# Altium project RoboFly.PrjPCB
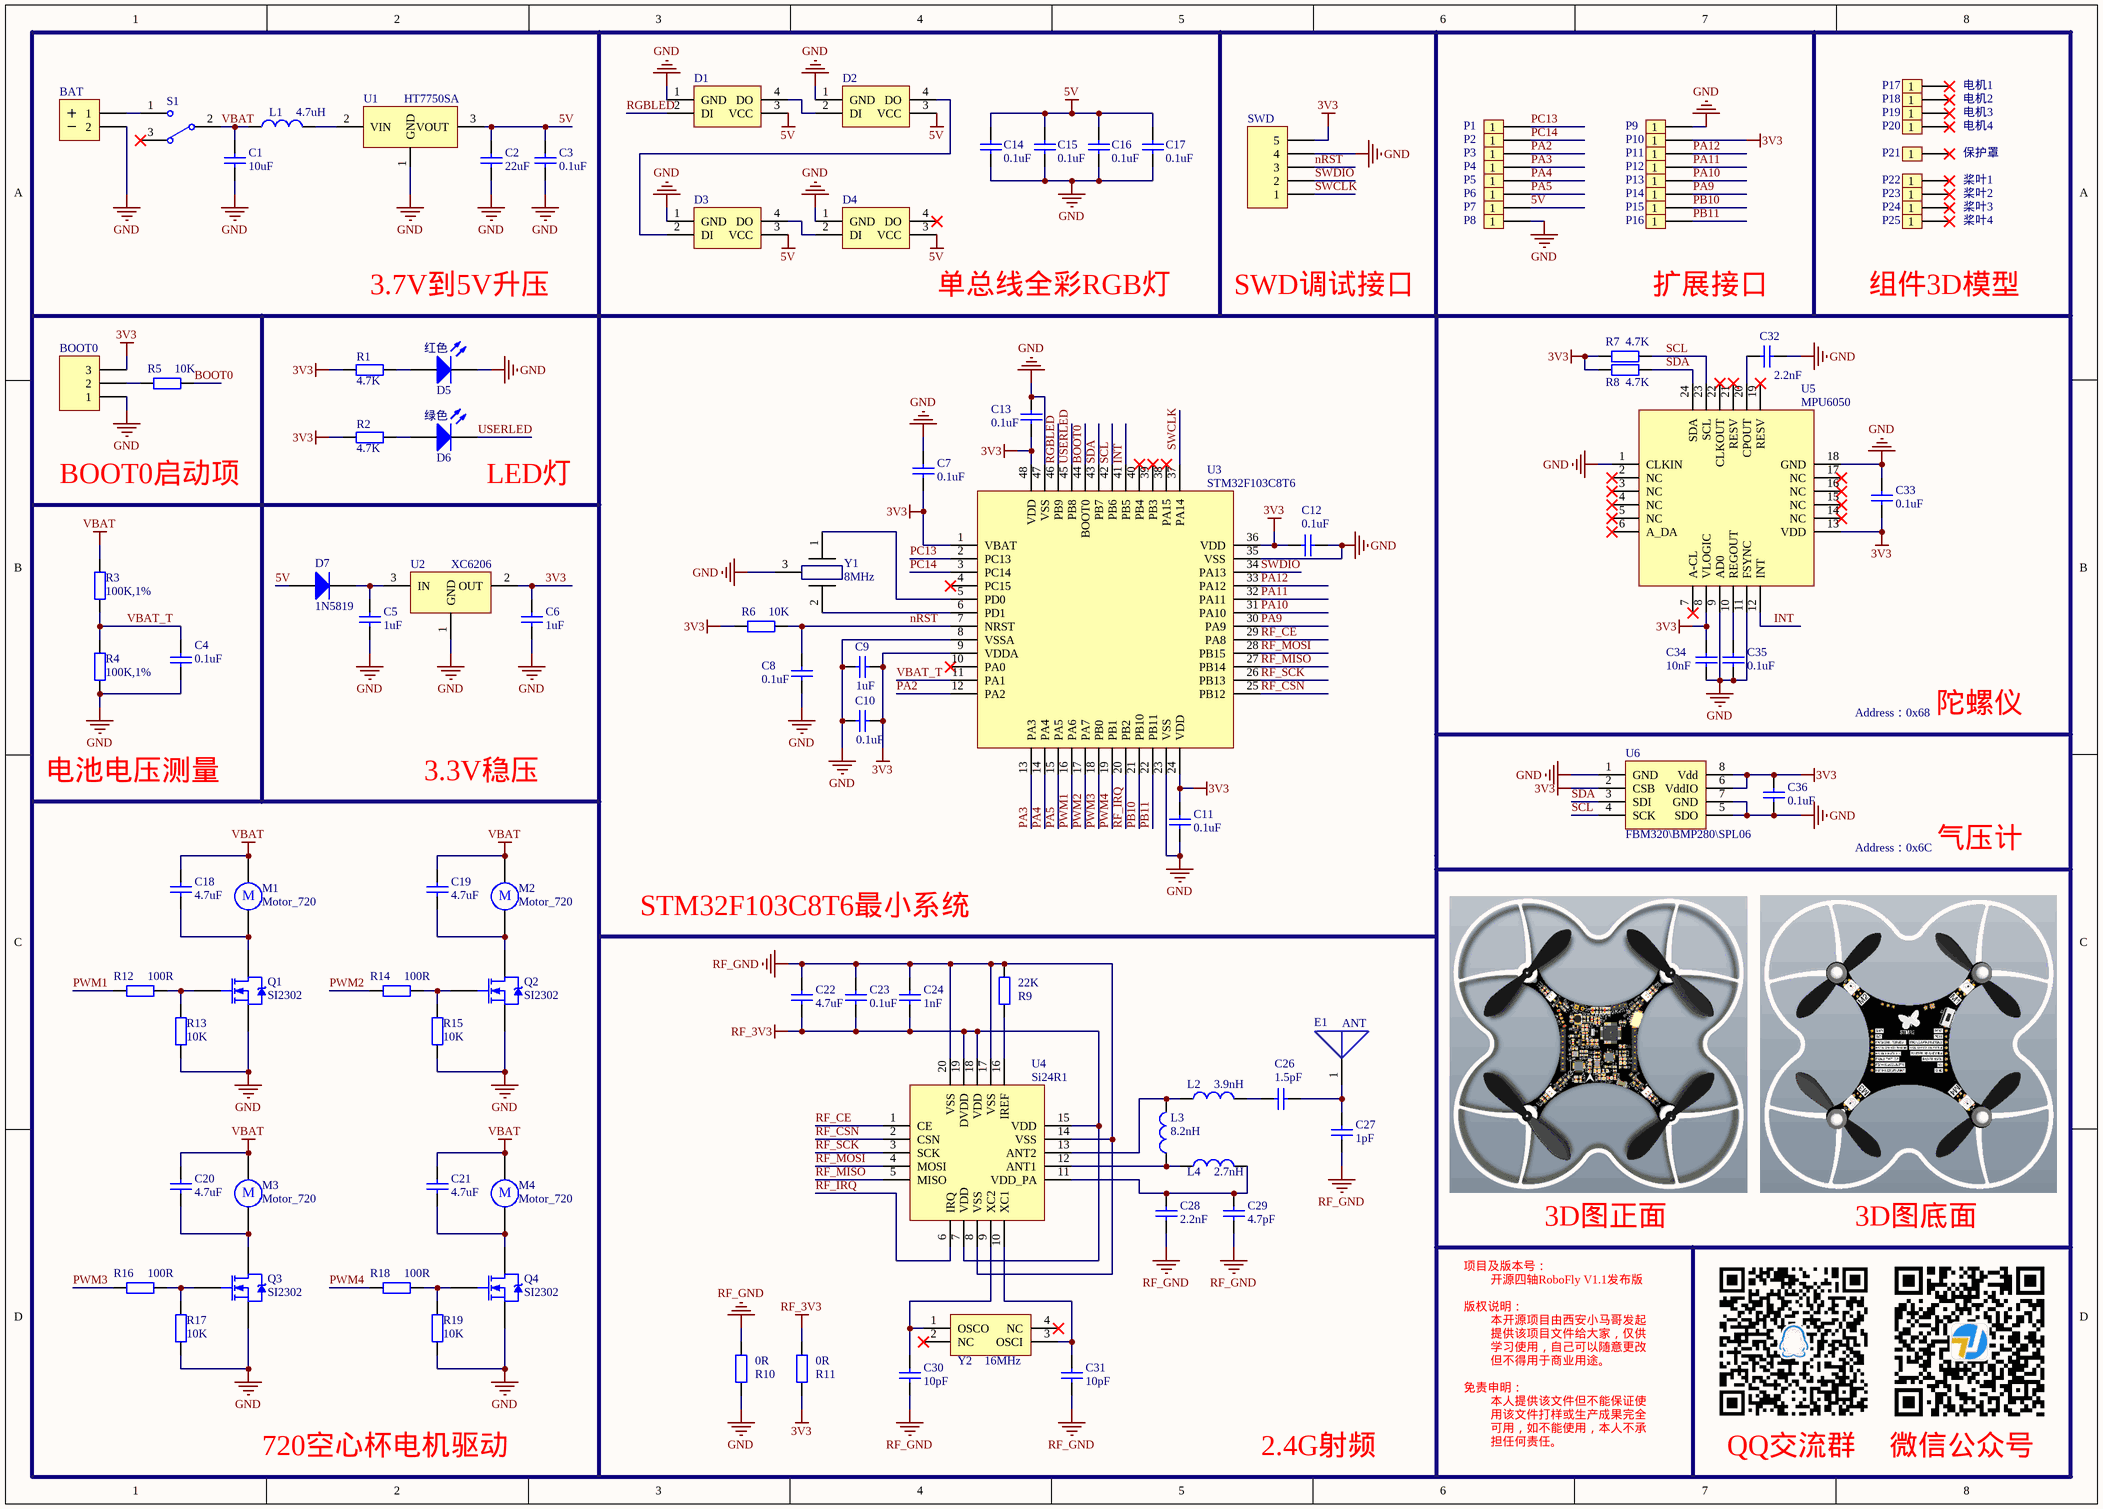
[diagram p0: RoboFly.SchDoc]
1 sheet, 111 parts. Net scope: global (net labels, ports and power ports of the same name join across sheets).
Board files: RoboFly.PcbDoc, STM32LOGO.PcbDoc

## Sheet RoboFly.SchDoc
size A3

### Parts
BAT  BAT  [BAT]  (value not drawn)
BOOT0  BOOT  [HEADER1X3]  (value not drawn)
C1  value 10uF  [C_0603]  (hidden comment: C_0603)
C2  value 22uF  [C_0603]  (hidden comment: C_0603)
C3  value 0.1uF  [C_0603]  (hidden comment: C_0603)
C4  value 0.1uF  [C_0603]  (hidden comment: C_0603)
C5  value 1uF  [C_0603]  (hidden comment: C_0603)
C6  value 1uF  [C_0603]  (hidden comment: C_0603)
C7  value 0.1uF  [C_0603]  (hidden comment: C_0603)
C8  value 0.1uF  [C_0603]  (hidden comment: C_0603)
C9  value 1uF  [C_0603]  (hidden comment: C_0603)
C10  value 0.1uF  [C_0603]  (hidden comment: C_0603)
C11  value 0.1uF  [C_0603]  (hidden comment: C_0603)
C12  value 0.1uF  [C_0603]  (hidden comment: C_0603)
C13  value 0.1uF  [C_0603]  (hidden comment: C_0603)
C14  value 0.1uF  [C_0603]  (hidden comment: C_0603)
C15  value 0.1uF  [C_0603]  (hidden comment: C_0603)
C16  value 0.1uF  [C_0603]  (hidden comment: C_0603)
C17  value 0.1uF  [C_0603]  (hidden comment: C_0603)
C18  value 4.7uF  [C_0603]  (hidden comment: C_0603)
C19  value 4.7uF  [C_0603]  (hidden comment: C_0603)
C20  value 4.7uF  [C_0603]  (hidden comment: C_0603)
C21  value 4.7uF  [C_0603]  (hidden comment: C_0603)
C22  value 4.7uF  [C_0603]  (hidden comment: C_0603)
C23  value 0.1uF  [C_0603]  (hidden comment: C_0603)
C24  value 1nF  [C_0603]  (hidden comment: C_0603)
C26  value 1.5pF  [C_0603]  (hidden comment: C_0603)
C27  value 1pF  [C_0603]  (hidden comment: C_0603)
C28  value 2.2nF  [C_0603]  (hidden comment: C_0603)
C29  value 4.7pF  [C_0603]  (hidden comment: C_0603)
C30  value 10pF  [C_0603]  (hidden comment: C_0603)
C31  value 10pF  [C_0603]  (hidden comment: C_0603)
C32  value 2.2nF  [C_0603]  (hidden comment: C_0603)
C33  value 0.1uF  [C_0603]  (hidden comment: C_0603)
C34  value 10nF  [C_0603]  (hidden comment: C_0603)
C35  value 0.1uF  [C_0603]  (hidden comment: C_0603)
C36  value 0.1uF  [C_0603]  (hidden comment: C_0603)
D1  P923D  [RGB_LED_5050]  (value not drawn)
D2  P923D  [RGB_LED_5050]  (value not drawn)
D3  P923D  [RGB_LED_5050]  (value not drawn)
D4  P923D  [RGB_LED_5050]  (value not drawn)
D5  红色  [LED-0603]
D6  绿色  [LED-0603]
D7  1N5819  [SOD-123]
E1  ANT  [ANT]
L1  value 4.7uH  [L_1210]  (hidden comment: Inductor)
L2  value 3.9nH  [L_0603]  (hidden comment: Inductor)
L3  value 8.2nH  [L_0603]  (hidden comment: Inductor)
L4  value 2.7nH  [L_0603]  (hidden comment: Inductor)
M1  Motor_720  [MOTOR]
M2  Motor_720  [MOTOR]
M3  Motor_720  [MOTOR]
M4  Motor_720  [MOTOR]
P1  Header 1  [HEADER1]  (value not drawn)
P2  Header 1  [HEADER1]  (value not drawn)
P3  Header 1  [HEADER1]  (value not drawn)
P4  Header 1  [HEADER1]  (value not drawn)
P5  Header 1  [HEADER1]  (value not drawn)
P6  Header 1  [HEADER1]  (value not drawn)
P7  Header 1  [HEADER1]  (value not drawn)
P8  Header 1  [HEADER1]  (value not drawn)
P9  Header 1  [HEADER1]  (value not drawn)
P10  Header 1  [HEADER1]  (value not drawn)
P11  Header 1  [HEADER1]  (value not drawn)
P12  Header 1  [HEADER1]  (value not drawn)
P13  Header 1  [HEADER1]  (value not drawn)
P14  Header 1  [HEADER1]  (value not drawn)
P15  Header 1  [HEADER1]  (value not drawn)
P16  Header 1  [HEADER1]  (value not drawn)
P17  Header 1  [720Motor]  (value not drawn)
P18  Header 1  [720Motor]  (value not drawn)
P19  Header 1  [720Motor]  (value not drawn)
P20  Header 1  [720Motor]  (value not drawn)
P21  Header 1  [PROTECT_COVER]  (value not drawn)
P22  Header 1  [BLADEB]  (value not drawn)
P23  Header 1  [BLADEA]  (value not drawn)
P24  Header 1  [BLADEB]  (value not drawn)
P25  Header 1  [BLADEA]  (value not drawn)
Q1  SI2302  [SOT-23(SOT-23-3)]
Q2  SI2302  [SOT-23(SOT-23-3)]
Q3  SI2302  [SOT-23(SOT-23-3)]
Q4  SI2302  [SOT-23(SOT-23-3)]
R1  value 4.7K  [R_0603]  (hidden comment: R_0603)
R2  value 4.7K  [R_0603]  (hidden comment: R_0603)
R3  value 100K,1%  [R_0603]  (hidden comment: R_0603)
R4  value 100K,1%  [R_0603]  (hidden comment: R_0603)
R5  value 10K  [R_0603]  (hidden comment: R_0603)
R6  value 10K  [R_0603]  (hidden comment: R_0603)
R7  value 4.7K  [R_0603]  (hidden comment: R_0603)
R8  value 4.7K  [R_0603]  (hidden comment: R_0603)
R9  value 22K  [R_0603]  (hidden comment: R_0603)
R10  value 0R  [R_0603]  (hidden comment: R_0603)
R11  value 0R  [R_0603]  (hidden comment: R_0603)
R12  value 100R  [R_0603]  (hidden comment: R_0603)
R13  value 10K  [R_0603]  (hidden comment: R_0603)
R14  value 100R  [R_0603]  (hidden comment: R_0603)
R15  value 10K  [R_0603]  (hidden comment: R_0603)
R16  value 100R  [R_0603]  (hidden comment: R_0603)
R17  value 10K  [R_0603]  (hidden comment: R_0603)
R18  value 100R  [R_0603]  (hidden comment: R_0603)
R19  value 10K  [R_0603]  (hidden comment: R_0603)
S1  SW-SPDT  [SWITCH_PWR]  (value not drawn)
SWD  SWD  [SH1_0X5P_WT]  (value not drawn)
U1  HT7750SA  [SOT-23(SOT-23-3)]
U2  XC6206  [SOT-23(SOT-23-3)]
U3  STM32F103C8T6  [LQFP-48_7x7x05P]
U4  Si24R1  [QFN20]
U5  MPU6050  [QFN-24_4x4x05P]
U6  FBM320\BMP280\SPL06  [LGA-2_5X2MM]
Y1  value 8MHz  [SMD-cstse800G52-r0]  (hidden comment: XTAL)
Y2  value 16MHz  [SMD-3225_4P]  (hidden comment: XTAL)

### Nets
3V3: BOOT0.3 C6.1 C7.2 C9.2 C10.2 C11.1 C12.2 C13.1 C33.2 C34.2 C36.1 P10.1 R1.1 R2.1 R6.2 R7.1 R8.1 R11.1 SWD.5 U2.2(OUT) U3.1(VBAT) U3.9(VDDA) U3.24(VDD) U3.36(VDD) U3.48(VDD) U5.8(VLOGIC) U5.13(VDD) U6.2(CSB) U6.6(VddIO) U6.8(Vdd)
5V: C2.1 C3.1 C14.2 C15.2 C16.2 C17.2 D1.3(VCC) D2.3(VCC) D3.3(VCC) D4.3(VCC) D7.1(A) P7.1 U1.3(VOUT)
GND: BAT.2 BOOT0.1 C1.2 C2.2 C3.2 C4.1 C5.2 C6.2 C7.1 C8.1 C9.1 C10.1 C11.2 C12.1 C13.2 C14.1 C15.1 C16.1 C17.1 C32.1 C33.1 C34.1 C35.2 C36.2 D1.1(GND) D2.1(GND) D3.1(GND) D4.1(GND) D5.2 P8.1 P9.1 Q1.2(S) Q2.2(S) Q3.2(S) Q4.2(S) R4.1 R10.1 R13.1 R15.1 R17.1 R19.1 SWD.4 U1.1(GND) U2.1(GND) U3.8(VSSA) U3.23(VSS) U3.35(VSS) U3.47(VSS) U5.1(CLKIN) U5.9(AD0) U5.11(FSYNC) U5.18(GND) U6.1(GND) U6.5(SDO) U6.7(GND) Y1.3
RF_3V3: C22.1 C23.1 C24.1 R11.2 U4.7(VDD) U4.15(VDD) U4.18(VDD) U4.19(DVDD)
RF_GND: C22.2 C23.2 C24.2 C27.1 C28.1 C29.1 C30.1 C31.1 R9.2 R10.2 U4.8(VSS) U4.14(VSS) U4.17(VSS) U4.20(VSS)
VBAT: C1.1 C18.2 C19.2 C20.2 C21.2 L1.1 M1.1 M2.1 M3.1 M4.1 R3.2 S1.2
BOOT0: R5.2 U3.44(BOOT0)
INT: U3.41(PB5) U5.12(INT)
nRST: C8.2 R6.1 SWD.3 U3.7(NRST)
PA2: P3.1 U3.12(PA2)
PA3: P4.1 U3.13(PA3)
PA4: P5.1 U3.14(PA4)
PA5: P6.1 U3.15(PA5)
PA9: P14.1 U3.30(PA9)
PA10: P13.1 U3.31(PA10)
PA11: P12.1 U3.32(PA11)
PA12: P11.1 U3.33(PA12)
PB10: P15.1 U3.21(PB10)
PB11: P16.1 U3.22(PB11)
PC13: P1.1 U3.2(PC13)
PC14: P2.1 U3.3(PC14)
PWM1: R12.1 U3.16(PA6)
PWM2: R14.1 U3.17(PA7)
PWM3: R16.1 U3.18(PB0)
PWM4: R18.1 U3.19(PB1)
RF_CE: U3.29(PA8) U4.1(CE)
RF_CSN: U3.25(PB12) U4.2(CSN)
RF_IRQ: U3.20(PB2) U4.6(IRQ)
RF_MISO: U3.27(PB14) U4.5(MISO)
RF_MOSI: U3.28(PB15) U4.4(MOSI)
RF_SCK: U3.26(PB13) U4.3(SCK)
RGBLED: D1.2(DI) U3.46(PB9)
SCL: R7.2 U3.42(PB6) U5.23(SCL) U6.4(SCK)
SDA: R8.2 U3.43(PB7) U5.24(SDA) U6.3(SDI)
SWCLK: SWD.1 U3.37(PA14)
SWDIO: SWD.2 U3.34(PA13)
USERLED: D6.2 U3.45(PB8)
VBAT_T: C4.2 R3.1 R4.2 U3.11(PA1)
NetBAT_1: BAT.1 S1.1
NetBOOT0_2: BOOT0.2 R5.1
NetC5_1: C5.1 D7.2(K) U2.3(IN)
NetC18_1: C18.1 M1.2 Q1.3(D)
NetC19_1: C19.1 M2.2 Q2.3(D)
NetC20_1: C20.1 M3.2 Q3.3(D)
NetC21_1: C21.1 M4.2 Q4.3(D)
NetC26_1: C26.1 L2.2
NetC26_2: C26.2 C27.2 E1.1
NetC28_2: C28.2 C29.2 L4.2 U4.11(VDD_PA)
NetC30_2: C30.2 U4.9(XC2) Y2.1(OSCO)
NetC31_2: C31.2 U4.10(XC1) Y2.3(OSCI)
NetC32_2: C32.2 U5.20(CPOUT)
NetC35_1: C35.1 U5.10(REGOUT)
NetD1_4: D1.4(DO) D2.2(DI)
NetD2_4: D2.4(DO) D3.2(DI)
NetD3_4: D3.4(DO) D4.2(DI)
NetD5_1: D5.1 R1.2
NetD6_1: D6.1 R2.2
NetL1_2: L1.2 U1.2(VIN)
NetL2_1: L2.1 L3.2 U4.13(ANT2)
NetL3_1: L3.1 L4.1 U4.12(ANT1)
NetQ1_1: Q1.1(G) R12.2 R13.2
NetQ2_1: Q2.1(G) R14.2 R15.2
NetQ3_1: Q3.1(G) R16.2 R17.2
NetQ4_1: Q4.1(G) R18.2 R19.2
NetR9_1: R9.1 U4.16(IREF)
NetU3_5: U3.5(PD0) Y1.1
NetU3_6: U3.6(PD1) Y1.2

Not connected (* = marked no-connect by the designer): D4 4(DO)*; P17 1*; P18 1*; P19 1*; P20 1*; P21 1*; P22 1*; P23 1*; P24 1*; P25 1*; S1 3*; U3 4(PC15)* 10(PA0)* 38(PA15)* 39(PB3)* 40(PB4)*; U5 2(NC)* 3(NC)* 4(NC)* 5(NC)* 6(A_DA)* 7(A-CL)* 14(NC)* 15(NC)* 16(NC)* 17(NC)* 19(RESV)* 21(RESV)* 22(CLKOUT)*; Y2 2(NC)* 4(NC)*

### Notes on the sheet
- 电机1
- 电机2
- 电机3
- 电机4
- 保护罩
- 桨叶1
- 桨叶3
- 桨叶2
- 桨叶4
- 3.7V到5V升压
- (near D4) 单总线全彩RGB灯
- SWD调试接口
- 扩展接口
- 组件3D模型
- BOOT0启动项
- (near D6) LED灯
- Address：0x68
- 陀螺仪
- 电池电压测量
- 3.3V稳压
- Address：0x6C
- 气压计
- STM32F103C8T6最小系统
- 3D图正面
- 3D图底面
- 版权说明：
- 项目及版本号：
- 本开源项目由西安小马哥发起
- 开源四轴RoboFly V1.1发布版
- 免责申明：
- 提供该项目文件给大家，仅供
- 学习使用，自己可以随意更改
- 但不得用于商业用途。
- 720空心杯电机驱动
- 2.4G射频
- 本人提供该文件但不能保证使
- 用该文件打样或生产成果完全
- 可用，如不能使用，本人不承
- 担任何责任。
- QQ交流群
- 微信公众号
- (in symbol Motor_720) M

### Library data of the parts
BAT = BAT: Header, 2-Pin; Publisher: mazhongwei; Published: 8-August-2017; PackageReference: HDR1X2
BOOT0 = Header 3: Header, 3-Pin; LatestRevisionDate: 17-Jul-2002; LatestRevisionNote: Re-released for DXP Platform.; Publisher: Altium Limited
D5 D6 = LED 0603: 发光二极管; Published: 8-Jun-2000; LatestRevisionDate: 08-Jul-2005; LatestRevisionNote: Mech Layer 1 removed.; PackageReference: LED-0; Publisher: Altium Limited; PackageDescription: LED; 2 Leads
D7 = Diode: Default Diode; Published: 8-August-2017; PackageReference: DO214AC; Publisher: mazhongwei
L1 = Inductor: 电感; Code_IEC: 1005; Published: 8-Jun-2000; LatestRevisionDate: 17-Jul-2002; LatestRevisionNote: Re-released for DXP Platform.; PackageReference: 0402-A; Publisher: Altium Limited; Code_JEITA: 0402
L2-L4 = Inductor_1: 电感; Code_IEC: 1005; Published: 8-Jun-2000; LatestRevisionDate: 17-Jul-2002; LatestRevisionNote: Re-released for DXP Platform.; PackageReference: 0402-A; Publisher: Altium Limited; Code_JEITA: 0402
M1-M4 = Motor_720: Motor, General Kind; Published: 8-August-2017; PackageReference: RB5-10.5; Publisher: mazhongwei
Q1-Q4 = SI2302: N-Channel Power MOSFET; Published: 8-August-2017; PackageReference: SOT23-3; Publisher: mazhongwei
S1 = SW-SPDT: SPDT Subminiature Toggle Switch, Right Angle Mounting, Vertical Actuation; Published: 10-August-2017; PackageReference: SWITCH_PWR; Publisher: mazhongwei
SWD = Header 5: Header, 5-Pin; LatestRevisionDate: 17-Jul-2002; LatestRevisionNote: Re-released for DXP Platform.; Publisher: Altium Limited
U4 = nRF24L01
U6 = FBM320: 气压计; Published: 8-August-2017; Publisher: mazhongwei; PackageReference: LGA-2_5X2MM
Y1 = XTAL_2: Publisher: mazhongwei; Published: 8-August-2017; PackageReference: SMD-cstse800G52-r0
Y2 = XTAL16M
C1-C24 C26-C36 = C_0603: Published: 8-Jun-2000; LatestRevisionDate: 17-Jul-2002; LatestRevisionNote: Re-released for DXP Platform.; PackageReference: RAD-0.3; Publisher: Altium Limited; PackageDescription: Radial Cap, Thru-Hole; 2 Leads; 0.3 in Pin Spacing
D1-D4 = P923D: Publisher: mazhongwei; Published: 8-August-2017; PackageReference: RGB_LED_5050
E1 = ANT: Published: 12-August-2017; Publisher: mazhongwei; PackageReference: R_1206
P1-P25 = Header 1: LatestRevisionDate: 17-Jul-2002; LatestRevisionNote: Re-released for DXP Platform.; Publisher: Altium Limited
R1-R19 = R_0603: Published: 8-Jun-2000; LatestRevisionDate: 17-Jul-2002; LatestRevisionNote: Re-released for DXP Platform.; PackageReference: AXIAL-0.4; Publisher: Altium Limited; PackageDescription: Axial Device, Thru-Hole; 2 Leads; 0.4 in Pin Spacing
U2 = XC6206: PackageReference: SOT23-3; Published: 12-August-2017; Publisher: mazhongwei